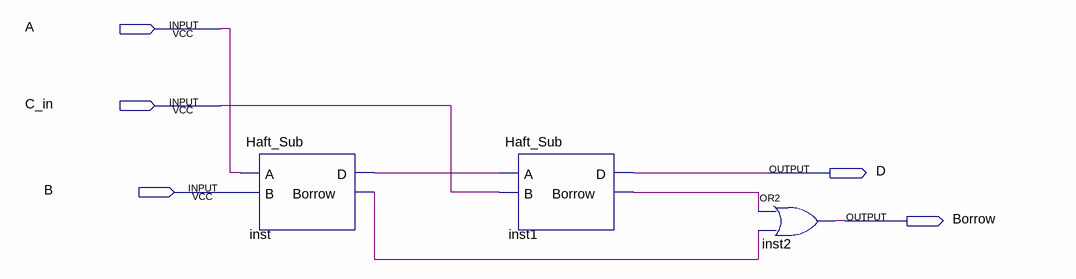
[diagram p0: schematic sheet]
// Quartus schematic Subtractor.bdf as structural Verilog: 3 symbols, 5 pins
module Subtractor (
  input  A,
  input  C_in,
  input  B,
  output D,
  output Borrow
);

  wire inst1_borrow, inst_borrow, inst_d;

  Haft_Sub inst (.A(A), .B(B), .D(inst_d), .Borrow(inst_borrow));
  Haft_Sub inst1 (.A(inst_d), .B(C_in), .D(D), .Borrow(inst1_borrow));
  or inst2 (Borrow, inst1_borrow, inst_borrow);
endmodule
